# Altium project Controller-Driver Integrated Board.PrjPcb
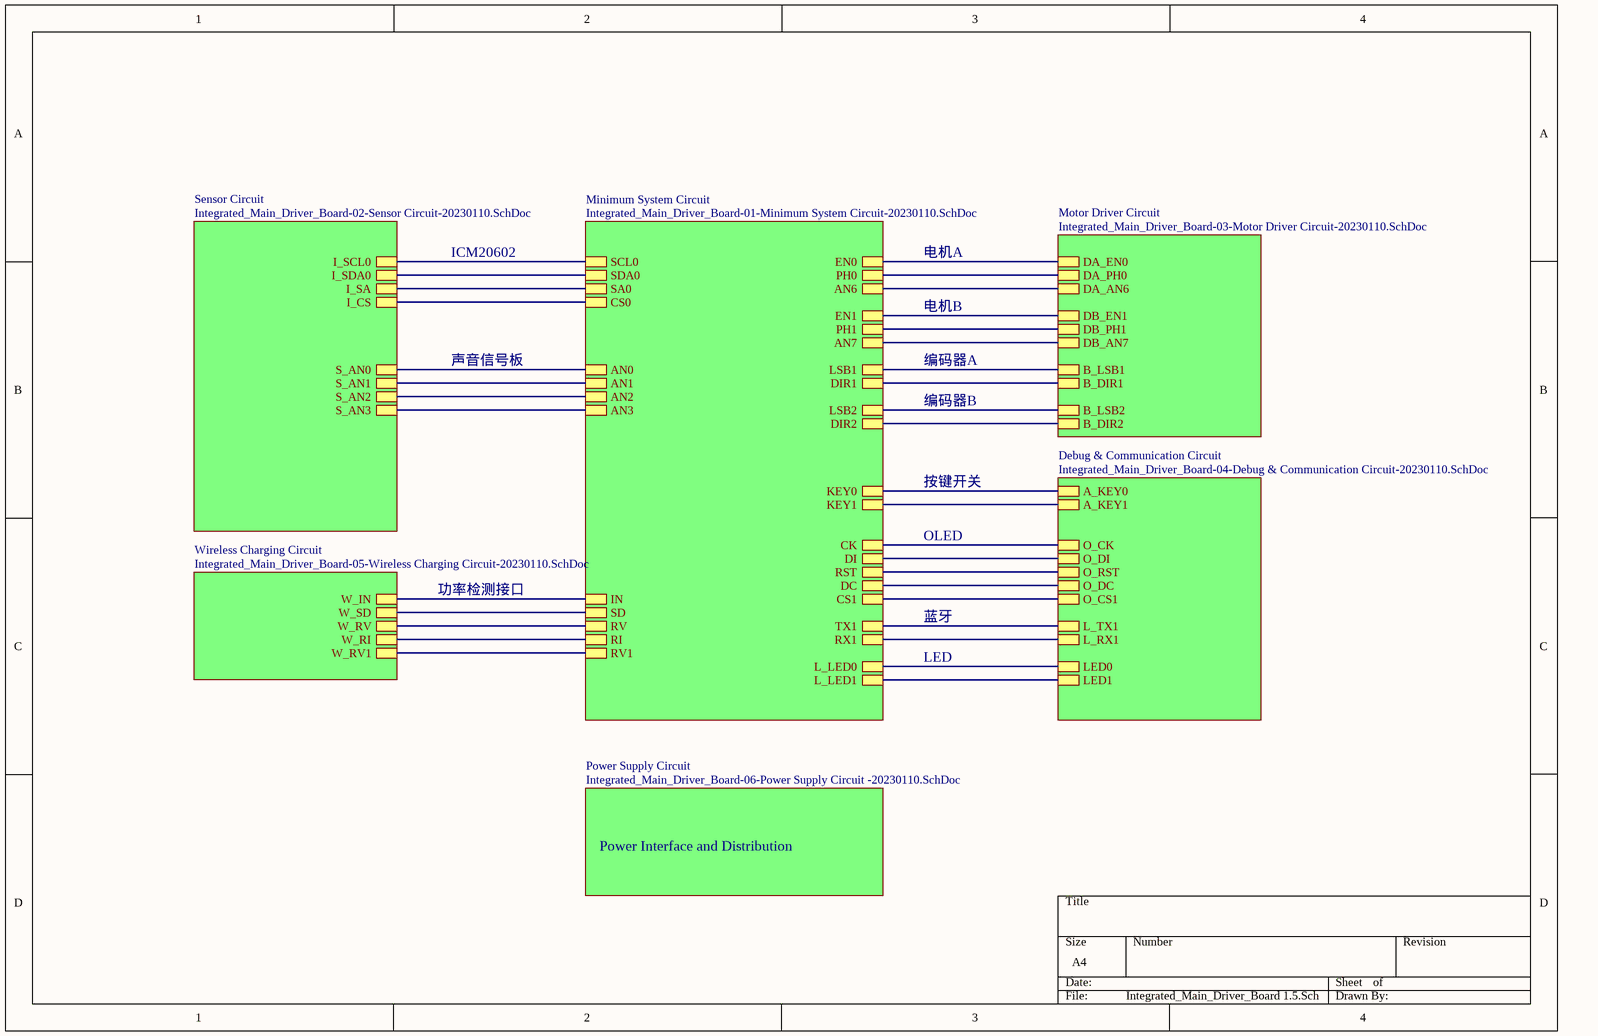
[diagram p0: Integrated_Main_Driver_Board 1.5.SchDoc]
7 sheets, 137 parts. Net scope: hierarchical (ports join the sheet entries above them; power ports are global).
Board file: Integrated_Main_Driver_Board 1.5.PcbDoc
Sheets:
  Integrated_Main_Driver_Board 1.5.SchDoc
    Minimum System Circuit = Integrated_Main_Driver_Board-01-Minimum System Circuit-20230110.SchDoc
    Wireless Charging Circuit = Integrated_Main_Driver_Board-05-Wireless Charging Circuit-20230110.SchDoc
    Sensor Circuit = Integrated_Main_Driver_Board-02-Sensor Circuit-20230110.SchDoc
    Motor Driver Circuit = Integrated_Main_Driver_Board-03-Motor Driver Circuit-20230110.SchDoc
    Debug & Communication Circuit = Integrated_Main_Driver_Board-04-Debug & Communication Circuit-20230110.SchDoc
    Power Supply Circuit = Integrated_Main_Driver_Board-06-Power Supply Circuit -20230110.SchDoc

## Sheet Integrated_Main_Driver_Board 1.5.SchDoc
size A4; SheetNumber: 1; SheetTotal: 7

### Sub-sheets
Debug & Communication Circuit = Integrated_Main_Driver_Board-04-Debug & Communication Circuit-20230110.SchDoc: A_KEY0, A_KEY1, O_CK, O_DI, O_RST, O_DC, O_CS1, L_TX1, L_RX1, LED0, LED1
Minimum System Circuit = Integrated_Main_Driver_Board-01-Minimum System Circuit-20230110.SchDoc: SCL0, SDA0, SA0, CS0, LSB1, LSB2, DIR1, DIR2, AN0, AN1, AN2, AN3, KEY0, KEY1, CK, DI, RST, DC, CS1, EN0, EN1, PH0, PH1, AN6, AN7, IN, SD, RV, RI, RV1, TX1, RX1, L_LED0, L_LED1
Motor Driver Circuit = Integrated_Main_Driver_Board-03-Motor Driver Circuit-20230110.SchDoc: DA_EN0, DA_PH0, DB_EN1, DB_PH1, DA_AN6, DB_AN7, B_LSB1, B_LSB2, B_DIR1, B_DIR2
Power Supply Circuit = Integrated_Main_Driver_Board-06-Power Supply Circuit -20230110.SchDoc: no entries
Sensor Circuit = Integrated_Main_Driver_Board-02-Sensor Circuit-20230110.SchDoc: I_CS, I_SA, I_SDA0, I_SCL0, S_AN0, S_AN1, S_AN2, S_AN3
Wireless Charging Circuit = Integrated_Main_Driver_Board-05-Wireless Charging Circuit-20230110.SchDoc: W_IN, W_SD, W_RV, W_RI, W_RV1

### Nets
NetC11_1: sheet Minimum System Circuit/KEY0, sheet Debug & Communication Circuit/A_KEY0
NetC12_1: sheet Minimum System Circuit/KEY1, sheet Debug & Communication Circuit/A_KEY1
NetC28_2: sheet Minimum System Circuit/AN6, sheet Motor Driver Circuit/DA_AN6
NetC37_2: sheet Minimum System Circuit/AN7, sheet Motor Driver Circuit/DB_AN7
NetD3_K: sheet Minimum System Circuit/L_LED0, sheet Debug & Communication Circuit/LED0
NetD4_K: sheet Minimum System Circuit/L_LED1, sheet Debug & Communication Circuit/LED1
NetLQ-TC1_3: sheet Minimum System Circuit/RI, sheet Wireless Charging Circuit/W_RI
NetLQ-TC1_4: sheet Minimum System Circuit/RV1, sheet Wireless Charging Circuit/W_RV1
NetLQ-TC1_7: sheet Minimum System Circuit/AN3, sheet Sensor Circuit/S_AN3
NetLQ-TC1_8: sheet Minimum System Circuit/RV, sheet Wireless Charging Circuit/W_RV
NetLQ-TC1_11: sheet Minimum System Circuit/AN2, sheet Sensor Circuit/S_AN2
NetLQ-TC1_13: sheet Minimum System Circuit/AN0, sheet Sensor Circuit/S_AN0
NetLQ-TC1_14: sheet Minimum System Circuit/AN1, sheet Sensor Circuit/S_AN1
NetLQ-TC1_22: sheet Minimum System Circuit/EN1, sheet Motor Driver Circuit/DB_EN1
NetLQ-TC1_24: sheet Minimum System Circuit/PH1, sheet Motor Driver Circuit/DB_PH1
NetLQ-TC1_29: sheet Minimum System Circuit/PH0, sheet Motor Driver Circuit/DA_PH0
NetLQ-TC1_32: sheet Minimum System Circuit/EN0, sheet Motor Driver Circuit/DA_EN0
NetLQ-TC1_34: sheet Minimum System Circuit/RX1, sheet Debug & Communication Circuit/L_RX1
NetLQ-TC1_37: sheet Minimum System Circuit/TX1, sheet Debug & Communication Circuit/L_TX1
NetLQ-TC1_48: sheet Minimum System Circuit/DIR1, sheet Motor Driver Circuit/B_DIR1
NetLQ-TC1_49: sheet Minimum System Circuit/LSB1, sheet Motor Driver Circuit/B_LSB1
NetLQ-TC1_56: sheet Minimum System Circuit/RST, sheet Debug & Communication Circuit/O_RST
NetLQ-TC1_57: sheet Minimum System Circuit/DI, sheet Debug & Communication Circuit/O_DI
NetLQ-TC1_58: sheet Minimum System Circuit/DC, sheet Debug & Communication Circuit/O_DC
NetLQ-TC1_59: sheet Minimum System Circuit/CS1, sheet Debug & Communication Circuit/O_CS1
NetLQ-TC1_60: sheet Minimum System Circuit/CK, sheet Debug & Communication Circuit/O_CK
NetLQ-TC1_61: sheet Minimum System Circuit/SA0, sheet Sensor Circuit/I_SA
NetLQ-TC1_67: sheet Minimum System Circuit/CS0, sheet Sensor Circuit/I_CS
NetLQ-TC1_68: sheet Minimum System Circuit/SCL0, sheet Sensor Circuit/I_SCL0
NetLQ-TC1_69: sheet Minimum System Circuit/SDA0, sheet Sensor Circuit/I_SDA0
NetLQ-TC1_88: sheet Minimum System Circuit/LSB2, sheet Motor Driver Circuit/B_LSB2
NetLQ-TC1_89: sheet Minimum System Circuit/DIR2, sheet Motor Driver Circuit/B_DIR2
NetLQ-TC1_103: sheet Minimum System Circuit/SD, sheet Wireless Charging Circuit/W_SD
NetLQ-TC1_104: sheet Minimum System Circuit/IN, sheet Wireless Charging Circuit/W_IN

### Notes on the sheet
- ICM20602
- 电机A
- 电机B
- 声音信号板
- 编码器A
- 编码器B
- 按键开关
- OLED
- 功率检测接口
- 蓝牙
- LED
- Power Interface and Distribution

## Sheet Integrated_Main_Driver_Board-01-Minimum System Circuit-20230110.SchDoc
size A4
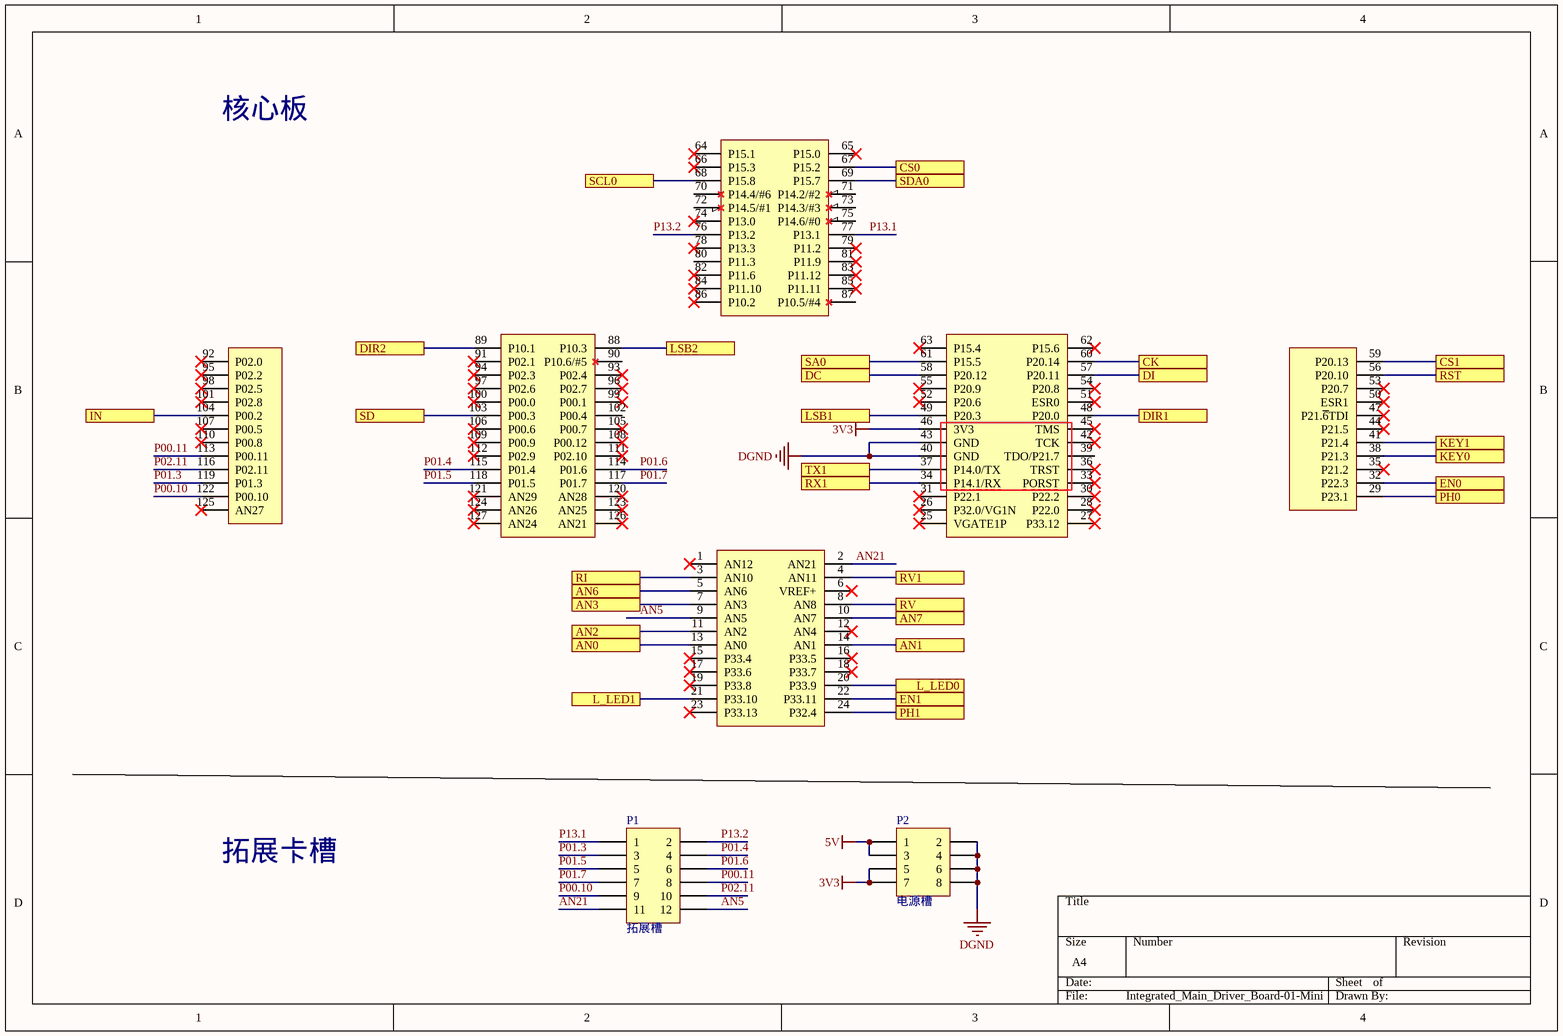
[diagram p1: Integrated_Main_Driver_Board-01-Minimum System Circuit-20230110.SchDoc]

### Parts
LQ-TC1  LQ-TC3X7-SYSVB  [TC377]  (value not drawn)
P1  拓展槽  [HDR2X6]
P2  电源槽  [HDR2X4]

### Ports
AN0, AN1, AN2, AN3, AN6, AN7, CK, CS0, CS1, DC, DI, DIR1, DIR2, EN0, EN1, IN, KEY0, KEY1, L_LED0, L_LED1, LSB1, LSB2, PH0, PH1, RI, RST, RV, RV1, RX1, SA0, SCL0, SD, SDA0, TX1

### Nets
3V3: LQ-TC1.46(3V3) P2.5 P2.7
5V: P2.1 P2.3
DGND: LQ-TC1.40(GND) LQ-TC1.43(GND) P2.2 P2.4 P2.6 P2.8
AN5: LQ-TC1.9(AN5) P1.12
AN21: LQ-TC1.2(AN21) P1.11
P00.10: LQ-TC1.122(P00.10) P1.9
P00.11: LQ-TC1.113(P00.11) P1.8
P01.3: LQ-TC1.119(P01.3) P1.3
P01.4: LQ-TC1.115(P01.4) P1.4
P01.5: LQ-TC1.118(P01.5) P1.5
P01.6: LQ-TC1.114(P01.6) P1.6
P01.7: LQ-TC1.117(P01.7) P1.7
P02.11: LQ-TC1.116(P02.11) P1.10
P13.1: LQ-TC1.77(P13.1) P1.1
P13.2: LQ-TC1.76(P13.2) P1.2
NetC11_1: LQ-TC1.38(P21.3) ; port KEY0
NetC12_1: LQ-TC1.41(P21.4) ; port KEY1
NetC28_2: LQ-TC1.5(AN6) ; port AN6
NetC37_2: LQ-TC1.10(AN7) ; port AN7
NetD3_K: LQ-TC1.20(P33.9) ; port L_LED0
NetD4_K: LQ-TC1.21(P33.10) ; port L_LED1
NetLQ-TC1_3: LQ-TC1.3(AN10) ; port RI
NetLQ-TC1_4: LQ-TC1.4(AN11) ; port RV1
NetLQ-TC1_7: LQ-TC1.7(AN3) ; port AN3
NetLQ-TC1_8: LQ-TC1.8(AN8) ; port RV
NetLQ-TC1_11: LQ-TC1.11(AN2) ; port AN2
NetLQ-TC1_13: LQ-TC1.13(AN0) ; port AN0
NetLQ-TC1_14: LQ-TC1.14(AN1) ; port AN1
NetLQ-TC1_22: LQ-TC1.22(P33.11) ; port EN1
NetLQ-TC1_24: LQ-TC1.24(P32.4) ; port PH1
NetLQ-TC1_29: LQ-TC1.29(P23.1) ; port PH0
NetLQ-TC1_32: LQ-TC1.32(P22.3) ; port EN0
NetLQ-TC1_34: LQ-TC1.34(P14.1/RX) ; port RX1
NetLQ-TC1_37: LQ-TC1.37(P14.0/TX) ; port TX1
NetLQ-TC1_48: LQ-TC1.48(P20.0) ; port DIR1
NetLQ-TC1_49: LQ-TC1.49(P20.3) ; port LSB1
NetLQ-TC1_56: LQ-TC1.56(P20.10) ; port RST
NetLQ-TC1_57: LQ-TC1.57(P20.11) ; port DI
NetLQ-TC1_58: LQ-TC1.58(P20.12) ; port DC
NetLQ-TC1_59: LQ-TC1.59(P20.13) ; port CS1
NetLQ-TC1_60: LQ-TC1.60(P20.14) ; port CK
NetLQ-TC1_61: LQ-TC1.61(P15.5) ; port SA0
NetLQ-TC1_67: LQ-TC1.67(P15.2) ; port CS0
NetLQ-TC1_68: LQ-TC1.68(P15.8) ; port SCL0
NetLQ-TC1_69: LQ-TC1.69(P15.7) ; port SDA0
NetLQ-TC1_88: LQ-TC1.88(P10.3) ; port LSB2
NetLQ-TC1_89: LQ-TC1.89(P10.1) ; port DIR2
NetLQ-TC1_103: LQ-TC1.103(P00.3) ; port SD
NetLQ-TC1_104: LQ-TC1.104(P00.2) ; port IN

Not connected (* = marked no-connect by the designer): LQ-TC1 1(AN12)* 6(VREF+)* 12(AN4)* 15(P33.4)* 16(P33.5)* 17(P33.6)* 18(P33.7)* 19(P33.8)* 23(P33.13)* 25(VGATE1P)* 26(P32.0/VG1N)* 27(P33.12)* 28(P22.0)* 30(P22.2)* 31(P22.1)* 33(PORST)* 35(P21.2)* 36(TRST)* 39(TDO/P21.7) 42(TCK)* 44(P21.5)* 45(TMS)* 47(P21.~{6}TDI)* 50(ESR1)* 51(ESR0)* 52(P20.6)* 53(P20.7)* 54(P20.8)* 55(P20.9)* 62(P15.6)* 63(P15.4)* 64(P15.1)* 65(P15.0)* 66(P15.3)* 70(P14.4/#6) 71(P14.2/#2) 72(P14.5/#1) 73(P14.3/#3) 74(P13.0)* 75(P14.6/#0) 78(P13.3)* 79(P11.2)* 80(P11.3) 81(P11.9)* 82(P11.6)* 83(P11.12)* 84(P11.10)* 85(P11.11)* 86(P10.2)* 87(P10.5/#4) 90(P10.6/#5) 91(P02.1)* 92(P02.0)* 93(P02.4)* 94(P02.3)* 95(P02.2)* 96(P02.7)* 97(P02.6)* 98(P02.5)* 99(P00.1)* 100(P00.0)* 101(P02.8)* 102(P00.4) 105(P00.7)* 106(P00.6)* 107(P00.5)* 108(P00.12)* 109(P00.9)* 110(P00.8)* 111(P02.10)* 112(P02.9)* 120(AN28)* 121(AN29)* 123(AN25)* 124(AN26)* 125(AN27)* 126(AN21)* 127(AN24)*

### Notes on the sheet
- (near LQ-TC1) 核心板
- 拓展卡槽

### Library data of the parts
P1 = Header 6X2: Header, 6-Pin, Dual row; LatestRevisionDate: 17-Jul-2002; LatestRevisionNote: Re-released for DXP Platform.; Publisher: Altium Limited
P2 = Header 4X2: Header, 4-Pin, Dual row; LatestRevisionDate: 17-Jul-2002; LatestRevisionNote: Re-released for DXP Platform.; Publisher: Altium Limited

## Sheet Integrated_Main_Driver_Board-05-Wireless Charging Circuit-20230110.SchDoc
size A4
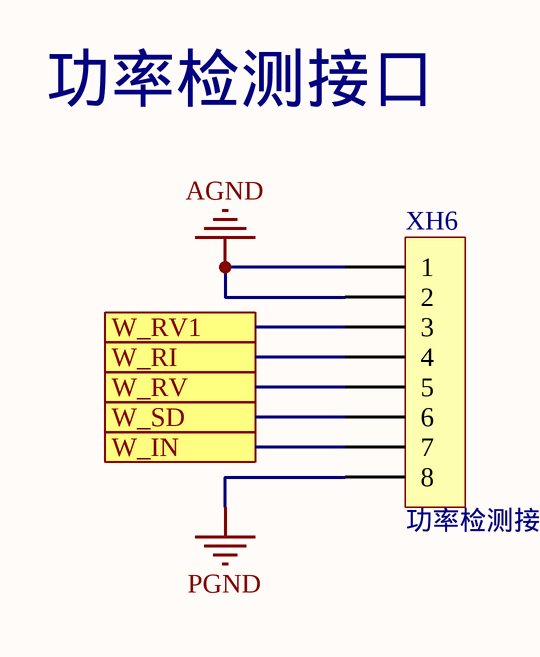
[diagram p2: Integrated_Main_Driver_Board-05-Wireless Charging Circuit-20230110.SchDoc]

### Parts
XH6  功率检测接口  [XH8/2.54mm/180]

### Ports
W_IN, W_RI, W_RV, W_RV1, W_SD

### Nets
AGND: XH6.1 XH6.2
PGND: XH6.8
NetLQ-TC1_3: XH6.4 ; port W_RI
NetLQ-TC1_4: XH6.3 ; port W_RV1
NetLQ-TC1_8: XH6.5 ; port W_RV
NetLQ-TC1_103: XH6.6 ; port W_SD
NetLQ-TC1_104: XH6.7 ; port W_IN

### Notes on the sheet
- 功率检测接口

### Library data of the parts
XH6 = XH8

## Sheet Integrated_Main_Driver_Board-02-Sensor Circuit-20230110.SchDoc
size A4
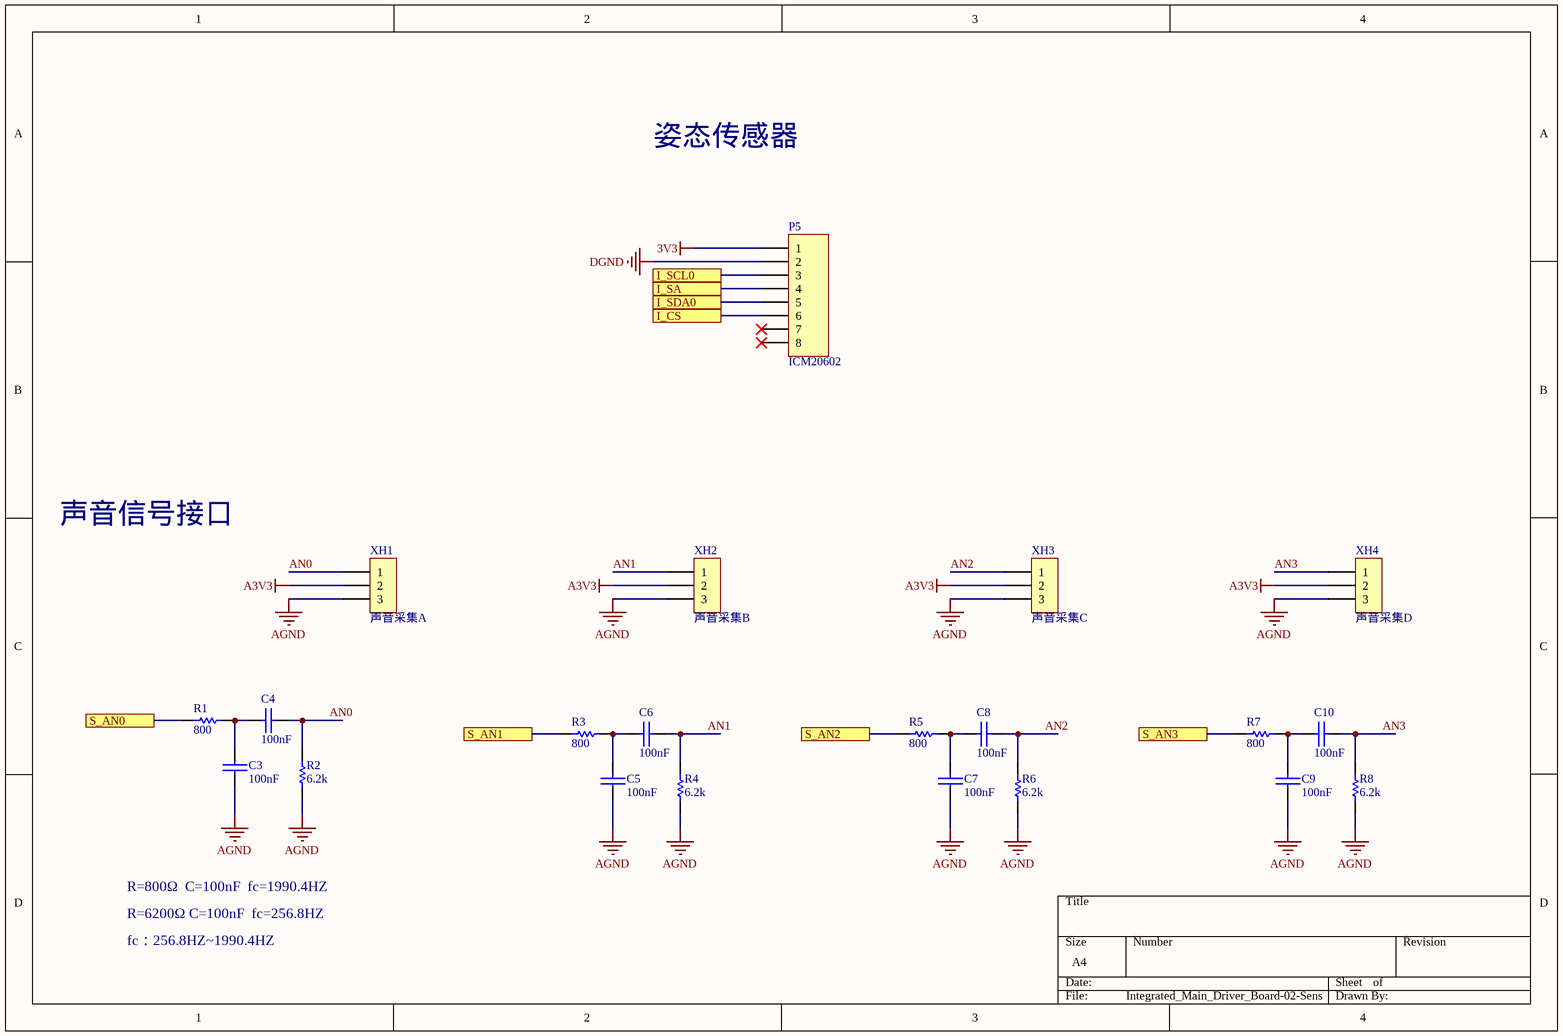
[diagram p3: Integrated_Main_Driver_Board-02-Sensor Circuit-20230110.SchDoc]

### Parts
C3  100nF  [0402C]
C4  100nF  [0402C]
C5  100nF  [0402C]
C6  100nF  [0402C]
C7  100nF  [0402C]
C8  100nF  [0402C]
C9  100nF  [0402C]
C10  100nF  [0402C]
P5  ICM20602  [HDR1X8]
R1  800  [0402R]
R2  6.2k  [0402R]
R3  800  [0402R]
R4  6.2k  [0402R]
R5  800  [0402R]
R6  6.2k  [0402R]
R7  800  [0402R]
R8  6.2k  [0402R]
XH1  声音采集A  [XH3/2.54mm/180]
XH2  声音采集B  [XH3/2.54mm/180]
XH3  声音采集C  [XH3/2.54mm/180]
XH4  声音采集D  [XH3/2.54mm/180]

### Ports
I_CS, I_SA, I_SCL0, I_SDA0, S_AN0, S_AN1, S_AN2, S_AN3

### Nets
3V3: P5.1
A3V3: XH1.2 XH2.2 XH3.2 XH4.2
AGND: C3.1 C5.1 C7.1 C9.1 R2.1 R4.1 R6.1 R8.1 XH1.3 XH2.3 XH3.3 XH4.3
DGND: P5.2
AN0: C4.1 R2.2 XH1.1
AN1: C6.1 R4.2 XH2.1
AN2: C8.1 R6.2 XH3.1
AN3: C10.1 R8.2 XH4.1
NetC3_2: C3.2 C4.2 R1.2
NetC5_2: C5.2 C6.2 R3.2
NetC7_2: C7.2 C8.2 R5.2
NetC9_2: C9.2 C10.2 R7.2
NetLQ-TC1_7: R7.1 ; port S_AN3
NetLQ-TC1_11: R5.1 ; port S_AN2
NetLQ-TC1_13: R1.1 ; port S_AN0
NetLQ-TC1_14: R3.1 ; port S_AN1
NetLQ-TC1_61: P5.4 ; port I_SA
NetLQ-TC1_67: P5.6 ; port I_CS
NetLQ-TC1_68: P5.3 ; port I_SCL0
NetLQ-TC1_69: P5.5 ; port I_SDA0

Not connected (* = marked no-connect by the designer): P5 7* 8*

### Notes on the sheet
- 姿态传感器
- 声音信号接口
- R=800Ω  C=100nF  fc=1990.4HZ
- R=6200Ω C=100nF  fc=256.8HZ
- fc：256.8HZ~1990.4HZ

### Library data of the parts
C3-C10 = CAP: 无极性电容
P5 = Header 8: Header, 8-Pin; LatestRevisionDate: 17-Jul-2002; LatestRevisionNote: Re-released for DXP Platform.; Publisher: Altium Limited
R1-R8 = RES
XH1-XH4 = XH3

## Sheet Integrated_Main_Driver_Board-03-Motor Driver Circuit-20230110.SchDoc
size A4; SheetNumber: 4; SheetTotal: 7
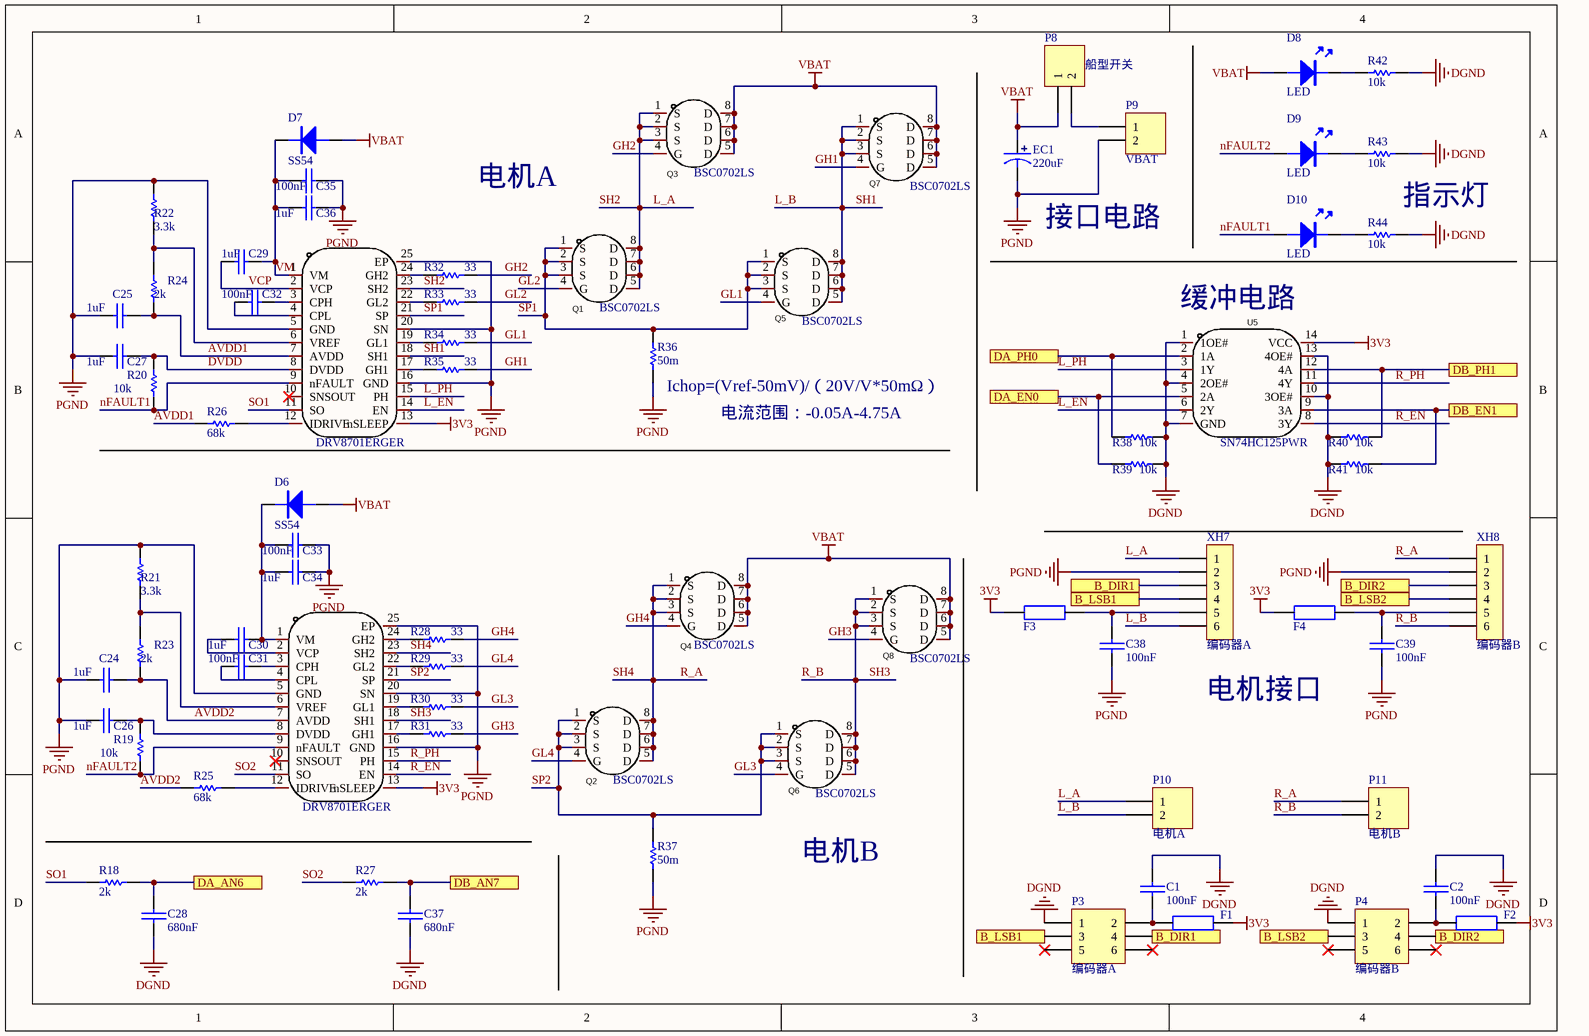
[diagram p4: Integrated_Main_Driver_Board-03-Motor Driver Circuit-20230110.SchDoc]

### Parts
C1  100nF  [0402C]
C2  100nF  [0402C]
C24  1uF  [0402C]
C25  1uF  [0402C]
C26  1uF  [0402C]
C27  1uF  [0402C]
C28  680nF  [0402C]
C29  1uF  [0402C]
C30  1uF  [0402C]
C31  100nF  [0402C]
C32  100nF  [0402C]
C33  100nF  [0402C]
C34  1uF  [0402C]
C35  100nF  [0402C]
C36  1uF  [0402C]
C37  680nF  [0402C]
C38  100nF  [0402C]
C39  100nF  [0402C]
D6  SS54  [SMA/DO-214AC]
D7  SS54  [SMA/DO-214AC]
D8  LED  [LED-0603B]
D9  LED  [LED-0603B]
D10  LED  [LED-0603B]
EC1  220uF  [SMD-EC6.3X6.3X10]
F1  500MA 0805  [0402]  (value not drawn)
F2  500MA 0805  [0402]  (value not drawn)
F3  500MA 0805  [0402R]  (value not drawn)
F4  500MA 0805  [0402R]  (value not drawn)
P3  编码器A  [HDR2X3]
P4  编码器B  [HDR2X3]
P8  船型开关  [船型开关]
P9  VBAT  [XT30U-M]
P10  电机A  [XT30U-M]
P11  电机B  [XT30U-M]
Q1  BSC0702LS  [BSC0702LS]
Q2  BSC0702LS  [BSC0702LS]
Q3  BSC0702LS  [BSC0702LS]
Q4  BSC0702LS  [BSC0702LS]
Q5  BSC0702LS  [BSC0702LS]
Q6  BSC0702LS  [BSC0702LS]
Q7  BSC0702LS  [BSC0702LS]
Q8  BSC0702LS  [BSC0702LS]
R18  2k  [0402R]
R19  10k  [0402R]
R20  10k  [0402R]
R21  3.3k  [0402R]
R22  3.3k  [0402R]
R23  2k  [0402R]
R24  2k  [0402R]
R25  68k  [0402R]
R26  68k  [0402R]
R27  2k  [0402R]
R28  33  [0402R]
R29  33  [0402R]
R30  33  [0402R]
R31  33  [0402R]
R32  33  [0402R]
R33  33  [0402R]
R34  33  [0402R]
R35  33  [0402R]
R36  50m  [1206R]
R37  50m  [1206R]
R38  10k  [0402R]
R39  10k  [0402R]
R40  10k  [0402R]
R41  10k  [0402R]
R42  10k  [0402R]
R43  10k  [0402R]
R44  10k  [0402R]
U3  DRV8701ERGER  [DRV8701ERGER]
U4  DRV8701ERGER  [DRV8701ERGER]
U5  SN74HC125PWR  [SN74HC125PWR]
XH7  编码器A  [XH6/2.54mm/180]
XH8  编码器B  [XH6/2.54mm/180]

### Ports
B_DIR1, B_DIR2, B_LSB1, B_LSB2, DA_AN6, DA_EN0, DA_PH0, DB_AN7, DB_EN1, DB_PH1

### Nets
3V3: F1.2 F2.1 F3.2 F4.1 U3.13(nSLEEP) U4.13(nSLEEP) U5.14(VCC)
DGND: C1.2 C2.2 C28.1 C37.1 P3.1 P4.1 R38.2 R39.2 R40.1 R41.1 R42.1 R43.1 R44.1 U5.1(1OE#) U5.4(2OE#) U5.7(GND) U5.10(3OE#) U5.13(4OE#)
PGND: C24.1 C25.1 C26.1 C27.1 C33.2 C34.2 C35.2 C36.2 C38.2 C39.2 EC1.2 P9.2 R21.1 R22.1 R36.1 R37.1 U3.5(GND) U3.16(GND) U3.20(SN) U3.25(EP) U4.5(GND) U4.16(GND) U4.20(SN) U4.25(EP) XH7.2 XH8.2
VBAT: D6.A D7.A D8.A EC1.1 P8.1 Q3.5(D) Q3.6(D) Q3.7(D) Q3.8(D) Q4.5(D) Q4.6(D) Q4.7(D) Q4.8(D) Q7.5(D) Q7.6(D) Q7.7(D) Q7.8(D) Q8.5(D) Q8.6(D) Q8.7(D) Q8.8(D)
AVDD1: C25.2 R24.2 R26.1 U4.7(AVDD)
AVDD2: C24.2 R23.2 R25.1 U3.7(AVDD)
DVDD: C27.2 R20.1 U4.8(DVDD)
GH1: Q7.4(G) R35.2
GH2: Q3.4(G) R32.2
GH3: Q8.4(G) R31.2
GH4: Q4.4(G) R28.2
GL1: Q5.4(G) R34.2
GL2: Q1.4(G) R33.2
GL3: Q6.4(G) R30.2
GL4: Q2.4(G) R29.2
L_A: P10.1 Q1.5(D) Q1.6(D) Q1.7(D) Q1.8(D) Q3.1(S) Q3.2(S) Q3.3(S) U4.23(SH2) XH7.1  [also labelled SH2]
L_B: P10.2 Q5.5(D) Q5.6(D) Q5.7(D) Q5.8(D) Q7.1(S) Q7.2(S) Q7.3(S) U4.18(SH1) XH7.6  [also labelled SH1]
L_EN: U4.14(EN) U5.6(2Y)
L_PH: U4.15(PH) U5.3(1Y)
nFAULT1: D10.A R20.2 U4.9(nFAULT)
nFAULT2: D9.A R19.2 U3.9(nFAULT)
R_A: P11.1 Q2.5(D) Q2.6(D) Q2.7(D) Q2.8(D) Q4.1(S) Q4.2(S) Q4.3(S) U3.23(SH2) XH8.1  [also labelled SH4]
R_B: P11.2 Q6.5(D) Q6.6(D) Q6.7(D) Q6.8(D) Q8.1(S) Q8.2(S) Q8.3(S) U3.18(SH1) XH8.6  [also labelled SH3]
R_EN: U3.14(EN) U5.8(3Y)
R_PH: U3.15(PH) U5.11(4Y)
SO1: R18.1 U4.11(SO)
SO2: R27.1 U3.11(SO)
SP1: Q1.1(S) Q1.2(S) Q1.3(S) Q5.1(S) Q5.2(S) Q5.3(S) R36.2 U4.21(SP)
SP2: Q2.1(S) Q2.2(S) Q2.3(S) Q6.1(S) Q6.2(S) Q6.3(S) R37.2 U3.21(SP)
VCP: C29.1 U4.2(VCP)
VM: C29.2 C35.1 C36.1 D7.K U4.1(VM)
NetC1_1: C1.1 F1.1 P3.2
NetC2_1: C2.1 F2.2 P4.2
NetC26_2: C26.2 R19.1 U3.8(DVDD)
NetC28_2: C28.2 R18.2 ; port DA_AN6
NetC30_1: C30.1 U3.2(VCP)
NetC30_2: C30.2 C33.1 C34.1 D6.K U3.1(VM)
NetC31_1: C31.1 U3.4(CPL)
NetC31_2: C31.2 U3.3(CPH)
NetC32_1: C32.1 U4.4(CPL)
NetC32_2: C32.2 U4.3(CPH)
NetC37_2: C37.2 R27.2 ; port DB_AN7
NetC38_1: C38.1 F3.1 XH7.5
NetC39_1: C39.1 F4.2 XH8.5
NetD8_K: D8.K R42.2
NetD9_K: D9.K R43.2
NetD10_K: D10.K R44.2
NetLQ-TC1_22: R41.2 U5.9(3A) ; port DB_EN1
NetLQ-TC1_24: R40.2 U5.12(4A) ; port DB_PH1
NetLQ-TC1_29: R38.1 U5.2(1A) ; port DA_PH0
NetLQ-TC1_32: R39.1 U5.5(2A) ; port DA_EN0
NetLQ-TC1_48: P3.4 XH7.3 ; port B_DIR1
NetLQ-TC1_49: P3.3 XH7.4 ; port B_LSB1
NetLQ-TC1_88: P4.3 XH8.4 ; port B_LSB2
NetLQ-TC1_89: P4.4 XH8.3 ; port B_DIR2
NetP8_2: P8.2 P9.1
NetR21_2: R21.2 R23.1 U3.6(VREF)
NetR22_2: R22.2 R24.1 U4.6(VREF)
NetR25_2: R25.2 U3.12(IDRIVE)
NetR26_2: R26.2 U4.12(IDRIVE)
NetR28_1: R28.1 U3.24(GH2)
NetR29_1: R29.1 U3.22(GL2)
NetR30_1: R30.1 U3.19(GL1)
NetR31_1: R31.1 U3.17(GH1)
NetR32_1: R32.1 U4.24(GH2)
NetR33_1: R33.1 U4.22(GL2)
NetR34_1: R34.1 U4.19(GL1)
NetR35_1: R35.1 U4.17(GH1)

Not connected (* = marked no-connect by the designer): P3 5* 6*; P4 5* 6*; U3 10(SNSOUT)*; U4 10(SNSOUT)*

### Notes on the sheet
- 电机A
- 接口电路
- 指示灯
- (near U5) 缓冲电路
- (near R36) Ichop=(Vref-50mV)/（20V/V*50mΩ）
- 电流范围：-0.05A-4.75A
- 电机接口
- 电机B

### Library data of the parts
C1 C24-C38 = CAP: 无极性电容
C2 C39 = CAP
D6 D7 = DIODE: 普通二极管
EC1 = SMD_ECAP: 贴片电解电容
F1-F4 = 0805 R_2
P3 P4 = Header 3X2: Header, 3-Pin, Dual row; LatestRevisionDate: 17-Jul-2002; LatestRevisionNote: Re-released for DXP Platform.; Publisher: Altium Limited
P8-P11 = Header 2: Header, 2-Pin; LatestRevisionDate: 17-Jul-2002; LatestRevisionNote: Re-released for DXP Platform.; Publisher: Altium Limited
Q1-Q8 = BSC0702LS: Manufacturer: Infineon(英飞凌); Add into BOM: yes; Type: N沟道; Drain Source Voltage (Vdss): 60V; Continuous Drain Current (Id): 100A; Power Dissipation (Pd): 83W; Drain Source On Resistance (RDS(on)@Vgs,Id): 2.3mΩ@10V,50A; Gate Threshold Voltage (Vgs(th)@Id): 2.3V@49μA; Name: BSC0702LS; Symbol: BSC0702LS; Device: BSC0702LS; LCSC Part Name: N沟道 60V 100A; Supplier Part: C501503; Manufacturer Part: BSC0702LS; Supplier Footprint: PG-TDSON-8; JLCPCB Part Class: Extended Part; Datasheet: https://atta.szlcsc.com/upload/public/pdf/source/20200324/C501503_BE3C55BAEEDCAD77F3934BFEE5415F86.pdf; Supplier: LCSC; Convert to PCB: yes
R18-R44 = RES
U3 U4 = DRV8701ERGER: Manufacturer: TI(德州仪器); Add into BOM: yes; Supply Voltage: 0V~5.5V; Interface: 并行; Name: DRV8701ERGER; Symbol: DRV8701ERGER; Device: DRV8701ERGER; LCSC Part Name: DRV8701ERGER; Supplier Part: C90964; Manufacturer Part: DRV8701ERGER; Supplier Footprint: VQFN-24; JLCPCB Part Class: Extended Part; Datasheet: https://atta.szlcsc.com/upload/public/pdf/source/20190902/C90964_2DCC43C1A4AE58E3ED96296E8C78517C.pdf; Supplier: LCSC; Convert to PCB: yes; Type: 有刷直流电机; current output: -; Operating Temperature: -40℃~+125℃@(Ta)
U5 = SN74HC125PWR: Manufacturer: TI(德州仪器); Add into BOM: yes; Logic Type: 缓冲器，非反向; Number of Elements: 4; Number of Bits per Element: 1; Output Type: 三态; Current - Output High, Low: 7.8mA、7.8mA; Voltage - Supply: 2V ~ 6V; Name: SN74HC125PWR; Symbol: SN74HC125PWR; Device: SN74HC125PWR; LCSC Part Name: SN74HC125PWR; Supplier Part: C132994; Manufacturer Part: SN74HC125PWR; Supplier Footprint: TSSOP-14; JLCPCB Part Class: Extended Part; Datasheet: https://atta.szlcsc.com/upload/public/pdf/source/20170930/C132994_1506736365150997346.pdf; Supplier: LCSC; Convert to PCB: yes; Series: 74HC; Input Type: -; Operating Temperature: -40℃~+85℃（TA）
XH7 XH8 = XH6

## Sheet Integrated_Main_Driver_Board-04-Debug & Communication Circuit-20230110.SchDoc
size A4
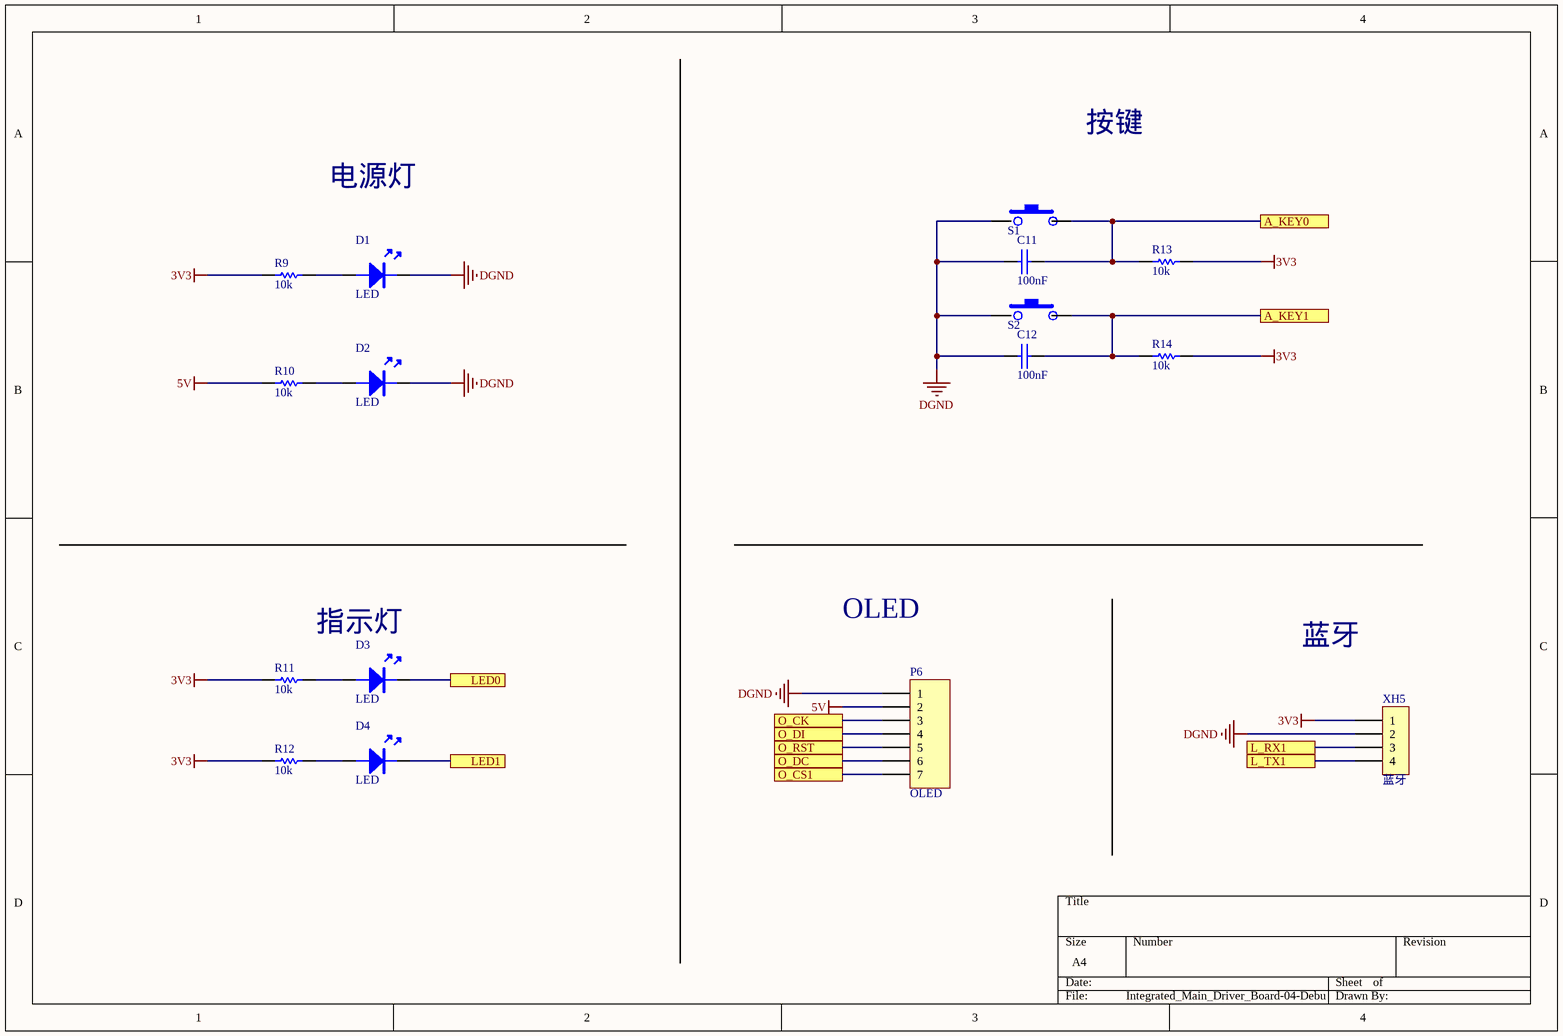
[diagram p5: Integrated_Main_Driver_Board-04-Debug & Communication Circuit-20230110.SchDoc]

### Parts
C11  100nF  [0402C]
C12  100nF  [0402C]
D1  LED  [LED-0603B]
D2  LED  [LED-0603B]
D3  LED  [LED-0603B]
D4  LED  [LED-0603B]
P6  OLED  [HDR1X7]
R9  10k  [0402R]
R10  10k  [0402R]
R11  10k  [0402R]
R12  10k  [0402R]
R13  10k  [0402R]
R14  10k  [0402R]
S1  轻触开关（3*6*2.5mm）  [轻触开关（3*6*2.5mm）]  (value not drawn)
S2  轻触开关（3*6*2.5mm）  [轻触开关（3*6*2.5mm）]  (value not drawn)
XH5  蓝牙  [XH4/2.54mm/180]

### Ports
A_KEY0, A_KEY1, L_RX1, L_TX1, LED0, LED1, O_CK, O_CS1, O_DC, O_DI, O_RST

### Nets
3V3: R9.1 R11.1 R12.1 R13.2 R14.2 XH5.1
5V: P6.2 R10.1
DGND: C11.2 C12.2 D1.K D2.K P6.1 S1.1 S2.1 XH5.2
NetC11_1: C11.1 R13.1 S1.2 ; port A_KEY0
NetC12_1: C12.1 R14.1 S2.2 ; port A_KEY1
NetD1_A: D1.A R9.2
NetD2_A: D2.A R10.2
NetD3_A: D3.A R11.2
NetD3_K: D3.K ; port LED0
NetD4_A: D4.A R12.2
NetD4_K: D4.K ; port LED1
NetLQ-TC1_34: XH5.3 ; port L_RX1
NetLQ-TC1_37: XH5.4 ; port L_TX1
NetLQ-TC1_56: P6.5 ; port O_RST
NetLQ-TC1_57: P6.4 ; port O_DI
NetLQ-TC1_58: P6.6 ; port O_DC
NetLQ-TC1_59: P6.7 ; port O_CS1
NetLQ-TC1_60: P6.3 ; port O_CK

### Notes on the sheet
- 按键
- 电源灯
- 指示灯
- OLED
- 蓝牙

### Library data of the parts
C11 C12 = CAP
P6 = Header 7: Header, 7-Pin; LatestRevisionDate: 17-Jul-2002; LatestRevisionNote: Re-released for DXP Platform.; Publisher: Altium Limited
R9-R14 = RES
S1 S2 = 轻触开关 3*6*2.5mm
XH5 = XH4

## Sheet Integrated_Main_Driver_Board-06-Power Supply Circuit -20230110.SchDoc
size A4
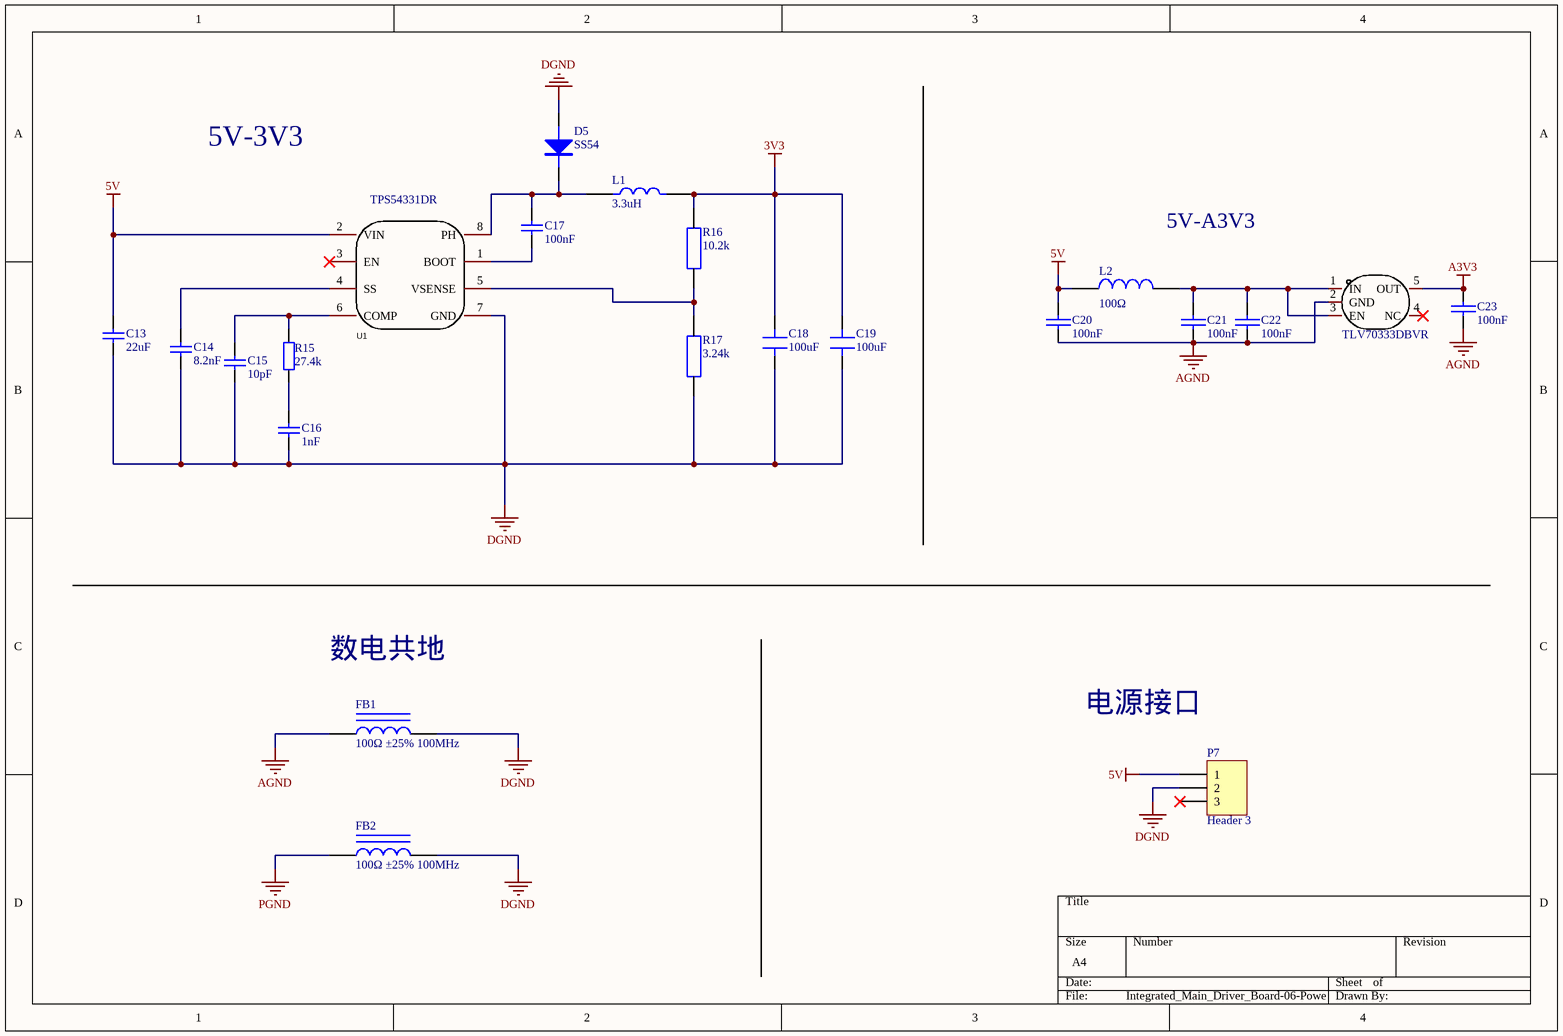
[diagram p6: Integrated_Main_Driver_Board-06-Power Supply Circuit -20230110.SchDoc]

### Parts
C13  22uF  [0805C]
C14  8.2nF  [0402C]
C15  10pF  [0402C]
C16  1nF  [0402C]
C17  100nF  [0402C]
C18  100uF  [1206C]
C19  100uF  [1206C]
C20  100nF  [0402C]
C21  100nF  [0402C]
C22  100nF  [0402C]
C23  100nF  [0402C]
D5  SS54  [DO-15]
FB1  100Ω ±25% 100MHz  [磁珠0402]
FB2  100Ω ±25% 100MHz  [磁珠0402]
L1  3.3uH  [0630L]
L2  100Ω  [0805L]
P7  Header 3  [3V-12V to 5.00V @ 3A]
R15  27.4k  [0402R]
R16  10.2k  [0402R]
R17  3.24k  [0402R]
U1  TPS54331DR  [TPS54331DR]
U2  TLV70333DBVR  [TLV70333]

### Nets
3V3: C18.2 C19.2 L1.2 R16.2
5V: C13.2 C20.2 L2.1 P7.1 U1.2(VIN)
A3V3: C23.2 U2.5(OUT)
AGND: C20.1 C21.1 C22.1 C23.1 FB1.1 U2.2(GND)
DGND: C13.1 C14.2 C15.1 C16.1 C18.1 C19.1 D5.A FB1.2 FB2.2 P7.2 R17.1 U1.7(GND)
PGND: FB2.1
NetC14_1: C14.1 U1.4(SS)
NetC15_2: C15.2 R15.2 U1.6(COMP)
NetC16_2: C16.2 R15.1
NetC17_1: C17.1 U1.1(BOOT)
NetC17_2: C17.2 D5.K L1.1 U1.8(PH)
NetC21_2: C21.2 C22.2 L2.2 U2.1(IN) U2.3(EN)
NetR16_1: R16.1 R17.2 U1.5(VSENSE)

Not connected (* = marked no-connect by the designer): P7 3*; U1 3(EN)*; U2 4(NC)*

### Notes on the sheet
- 5V-3V3
- 5V-A3V3
- 数电共地
- 电源接口

### Library data of the parts
C13 C15 C16 = 0805 10uF (106) 10% 25V: 贴片电容; ComponentLink1Description: 供应商链接; ComponentLink1URL: http://www.szlcsc.com/product/details_16532.html; Package: 0805; Supplier: LC; SuppliersPartNumber: C15850
C14 = 0805 2.0pF (2R0) 0.25pF 50V: 贴片电容; ComponentLink1Description: 供应商链接; ComponentLink1URL: http://www.szlcsc.com/product/details_2152.html; Package: 0805; Supplier: LC; SuppliersPartNumber: C1800
C17 = 0805 100nF(104) 10% 50V: 贴片电容; ComponentLink1Description: 供应商链接; ComponentLink1URL: http://www.szlcsc.com/product/details_50686.html; Package: 0805; Supplier: LC; SuppliersPartNumber: C49678
C18 C19 = 47uF 0805
C20-C23 = CAP: 无极性电容
D5 = DIODE: 普通二极管
FB1 FB2 = 0805 100Ω 25% 100MHz: 贴片磁珠; ComponentLink1Description: 供应商链接; ComponentLink1URL: http://www.szlcsc.com/product/details_1367.html; Package: 0805; Supplier: LC; SuppliersPartNumber: C1015
L1 = 15uH 电感
L2 = INDUCTOR
P7 = Header 3: Header, 3-Pin; LatestRevisionDate: 17-Jul-2002; LatestRevisionNote: Re-released for DXP Platform.; Publisher: Altium Limited
R15 = 0805 10MΩ (1005) 1%: 贴片电阻; ComponentLink1Description: 供应商链接; ComponentLink1URL: http://www.szlcsc.com/product/details_26851.html; Package: 0805; Supplier: LC; SuppliersPartNumber: C26108
R16 R17 = 10K 0805
U1 = TPS54331DR: Manufacturer: TI(德州仪器); Add into BOM: yes; Function: 降压型; Symbol: TPS54331DR; Device: TPS54331DR; LCSC Part Name: 降压型; Supplier Part: C9865; Manufacturer Part: TPS54331DR; Supplier Footprint: SOIC-8_150mil; JLCPCB Part Class: Basic Part; Datasheet: https://atta.szlcsc.com/upload/public/pdf/source/20121112/1457706556448.pdf; Supplier: LCSC; Convert to PCB: yes; Synchronous Rectification: -; Number of Outputs: -; Topology: -; Input Voltage: -; Output Current (Max): -; Switching Frequency: -
U2 = TLV70333DBVR: Manufacturer: TI(德州仪器); Add into BOM: yes; Output Type: 固定; Output Polarity: 正; Number of Outputs: 1; Maximum Input Voltage: 5.5V; Output Voltage: 3.3V; Dropout Voltage: 375mV@300mA; Quiescent Current (Ground Current): 55uA; Output Current: 300mA; Power Supply Rejection Ratio (PSRR): 68dB@(1kHz); Noise: 48uVrms; Name: TLV70333DBVR; Symbol: TLV70333DBVR; Device: TLV70333DBVR; LCSC Part Name: 正 Vin=5.5V Vout=3.3V 300mA 68dB@(1kHz); Supplier Part: C2871194; Manufacturer Part: TLV70333DBVR; Supplier Footprint: SOT-23; JLCPCB Part Class: Extended Part; Datasheet: https://atta.szlcsc.com/upload/public/pdf/source/20210918/50FD5D831AE9FE2A9E2303D8DCF0EFD5.pdf; Supplier: LCSC; Convert to PCB: yes; Feature: 过热保护,过流保护，使能; Operating Temperature: -55℃~+150℃@(Tj)

## Nets that join several sheets
3V3: Integrated_Main_Driver_Board-01-Minimum System Circuit-20230110 (LQ-TC1.46 P2.5 P2.7), Integrated_Main_Driver_Board-02-Sensor Circuit-20230110 (P5.1), Integrated_Main_Driver_Board-03-Motor Driver Circuit-20230110 (7 pins), Integrated_Main_Driver_Board-04-Debug & Communication Circuit-20230110 (6 pins), Integrated_Main_Driver_Board-06-Power Supply Circuit -20230110 (C18.2 C19.2 L1.2 R16.2)
5V: Integrated_Main_Driver_Board-01-Minimum System Circuit-20230110 (P2.1 P2.3), Integrated_Main_Driver_Board-04-Debug & Communication Circuit-20230110 (P6.2 R10.1), Integrated_Main_Driver_Board-06-Power Supply Circuit -20230110 (5 pins)
A3V3: Integrated_Main_Driver_Board-02-Sensor Circuit-20230110 (XH1.2 XH2.2 XH3.2 XH4.2), Integrated_Main_Driver_Board-06-Power Supply Circuit -20230110 (C23.2 U2.5)
AGND: Integrated_Main_Driver_Board-05-Wireless Charging Circuit-20230110 (XH6.1 XH6.2), Integrated_Main_Driver_Board-02-Sensor Circuit-20230110 (12 pins), Integrated_Main_Driver_Board-06-Power Supply Circuit -20230110 (6 pins)
DGND: Integrated_Main_Driver_Board-01-Minimum System Circuit-20230110 (6 pins), Integrated_Main_Driver_Board-02-Sensor Circuit-20230110 (P5.2), Integrated_Main_Driver_Board-03-Motor Driver Circuit-20230110 (18 pins), Integrated_Main_Driver_Board-04-Debug & Communication Circuit-20230110 (8 pins), Integrated_Main_Driver_Board-06-Power Supply Circuit -20230110 (12 pins)
PGND: Integrated_Main_Driver_Board-05-Wireless Charging Circuit-20230110 (XH6.8), Integrated_Main_Driver_Board-03-Motor Driver Circuit-20230110 (26 pins), Integrated_Main_Driver_Board-06-Power Supply Circuit -20230110 (FB2.1)
NetC11_1: Integrated_Main_Driver_Board-01-Minimum System Circuit-20230110 (LQ-TC1.38), Integrated_Main_Driver_Board-04-Debug & Communication Circuit-20230110 (C11.1 R13.1 S1.2)
NetC12_1: Integrated_Main_Driver_Board-01-Minimum System Circuit-20230110 (LQ-TC1.41), Integrated_Main_Driver_Board-04-Debug & Communication Circuit-20230110 (C12.1 R14.1 S2.2)
NetC28_2: Integrated_Main_Driver_Board-01-Minimum System Circuit-20230110 (LQ-TC1.5), Integrated_Main_Driver_Board-03-Motor Driver Circuit-20230110 (C28.2 R18.2)
NetC37_2: Integrated_Main_Driver_Board-01-Minimum System Circuit-20230110 (LQ-TC1.10), Integrated_Main_Driver_Board-03-Motor Driver Circuit-20230110 (C37.2 R27.2)
NetD3_K: Integrated_Main_Driver_Board-01-Minimum System Circuit-20230110 (LQ-TC1.20), Integrated_Main_Driver_Board-04-Debug & Communication Circuit-20230110 (D3.K)
NetD4_K: Integrated_Main_Driver_Board-01-Minimum System Circuit-20230110 (LQ-TC1.21), Integrated_Main_Driver_Board-04-Debug & Communication Circuit-20230110 (D4.K)
NetLQ-TC1_3: Integrated_Main_Driver_Board-01-Minimum System Circuit-20230110 (LQ-TC1.3), Integrated_Main_Driver_Board-05-Wireless Charging Circuit-20230110 (XH6.4)
NetLQ-TC1_4: Integrated_Main_Driver_Board-01-Minimum System Circuit-20230110 (LQ-TC1.4), Integrated_Main_Driver_Board-05-Wireless Charging Circuit-20230110 (XH6.3)
NetLQ-TC1_7: Integrated_Main_Driver_Board-01-Minimum System Circuit-20230110 (LQ-TC1.7), Integrated_Main_Driver_Board-02-Sensor Circuit-20230110 (R7.1)
NetLQ-TC1_8: Integrated_Main_Driver_Board-01-Minimum System Circuit-20230110 (LQ-TC1.8), Integrated_Main_Driver_Board-05-Wireless Charging Circuit-20230110 (XH6.5)
NetLQ-TC1_11: Integrated_Main_Driver_Board-01-Minimum System Circuit-20230110 (LQ-TC1.11), Integrated_Main_Driver_Board-02-Sensor Circuit-20230110 (R5.1)
NetLQ-TC1_13: Integrated_Main_Driver_Board-01-Minimum System Circuit-20230110 (LQ-TC1.13), Integrated_Main_Driver_Board-02-Sensor Circuit-20230110 (R1.1)
NetLQ-TC1_14: Integrated_Main_Driver_Board-01-Minimum System Circuit-20230110 (LQ-TC1.14), Integrated_Main_Driver_Board-02-Sensor Circuit-20230110 (R3.1)
NetLQ-TC1_22: Integrated_Main_Driver_Board-01-Minimum System Circuit-20230110 (LQ-TC1.22), Integrated_Main_Driver_Board-03-Motor Driver Circuit-20230110 (R41.2 U5.9)
NetLQ-TC1_24: Integrated_Main_Driver_Board-01-Minimum System Circuit-20230110 (LQ-TC1.24), Integrated_Main_Driver_Board-03-Motor Driver Circuit-20230110 (R40.2 U5.12)
NetLQ-TC1_29: Integrated_Main_Driver_Board-01-Minimum System Circuit-20230110 (LQ-TC1.29), Integrated_Main_Driver_Board-03-Motor Driver Circuit-20230110 (R38.1 U5.2)
NetLQ-TC1_32: Integrated_Main_Driver_Board-01-Minimum System Circuit-20230110 (LQ-TC1.32), Integrated_Main_Driver_Board-03-Motor Driver Circuit-20230110 (R39.1 U5.5)
NetLQ-TC1_34: Integrated_Main_Driver_Board-01-Minimum System Circuit-20230110 (LQ-TC1.34), Integrated_Main_Driver_Board-04-Debug & Communication Circuit-20230110 (XH5.3)
NetLQ-TC1_37: Integrated_Main_Driver_Board-01-Minimum System Circuit-20230110 (LQ-TC1.37), Integrated_Main_Driver_Board-04-Debug & Communication Circuit-20230110 (XH5.4)
NetLQ-TC1_48: Integrated_Main_Driver_Board-01-Minimum System Circuit-20230110 (LQ-TC1.48), Integrated_Main_Driver_Board-03-Motor Driver Circuit-20230110 (P3.4 XH7.3)
NetLQ-TC1_49: Integrated_Main_Driver_Board-01-Minimum System Circuit-20230110 (LQ-TC1.49), Integrated_Main_Driver_Board-03-Motor Driver Circuit-20230110 (P3.3 XH7.4)
NetLQ-TC1_56: Integrated_Main_Driver_Board-01-Minimum System Circuit-20230110 (LQ-TC1.56), Integrated_Main_Driver_Board-04-Debug & Communication Circuit-20230110 (P6.5)
NetLQ-TC1_57: Integrated_Main_Driver_Board-01-Minimum System Circuit-20230110 (LQ-TC1.57), Integrated_Main_Driver_Board-04-Debug & Communication Circuit-20230110 (P6.4)
NetLQ-TC1_58: Integrated_Main_Driver_Board-01-Minimum System Circuit-20230110 (LQ-TC1.58), Integrated_Main_Driver_Board-04-Debug & Communication Circuit-20230110 (P6.6)
NetLQ-TC1_59: Integrated_Main_Driver_Board-01-Minimum System Circuit-20230110 (LQ-TC1.59), Integrated_Main_Driver_Board-04-Debug & Communication Circuit-20230110 (P6.7)
NetLQ-TC1_60: Integrated_Main_Driver_Board-01-Minimum System Circuit-20230110 (LQ-TC1.60), Integrated_Main_Driver_Board-04-Debug & Communication Circuit-20230110 (P6.3)
NetLQ-TC1_61: Integrated_Main_Driver_Board-01-Minimum System Circuit-20230110 (LQ-TC1.61), Integrated_Main_Driver_Board-02-Sensor Circuit-20230110 (P5.4)
NetLQ-TC1_67: Integrated_Main_Driver_Board-01-Minimum System Circuit-20230110 (LQ-TC1.67), Integrated_Main_Driver_Board-02-Sensor Circuit-20230110 (P5.6)
NetLQ-TC1_68: Integrated_Main_Driver_Board-01-Minimum System Circuit-20230110 (LQ-TC1.68), Integrated_Main_Driver_Board-02-Sensor Circuit-20230110 (P5.3)
NetLQ-TC1_69: Integrated_Main_Driver_Board-01-Minimum System Circuit-20230110 (LQ-TC1.69), Integrated_Main_Driver_Board-02-Sensor Circuit-20230110 (P5.5)
NetLQ-TC1_88: Integrated_Main_Driver_Board-01-Minimum System Circuit-20230110 (LQ-TC1.88), Integrated_Main_Driver_Board-03-Motor Driver Circuit-20230110 (P4.3 XH8.4)
NetLQ-TC1_89: Integrated_Main_Driver_Board-01-Minimum System Circuit-20230110 (LQ-TC1.89), Integrated_Main_Driver_Board-03-Motor Driver Circuit-20230110 (P4.4 XH8.3)
NetLQ-TC1_103: Integrated_Main_Driver_Board-01-Minimum System Circuit-20230110 (LQ-TC1.103), Integrated_Main_Driver_Board-05-Wireless Charging Circuit-20230110 (XH6.6)
NetLQ-TC1_104: Integrated_Main_Driver_Board-01-Minimum System Circuit-20230110 (LQ-TC1.104), Integrated_Main_Driver_Board-05-Wireless Charging Circuit-20230110 (XH6.7)